# EAGLE design sht21_board (EAGLE 7.2.0)
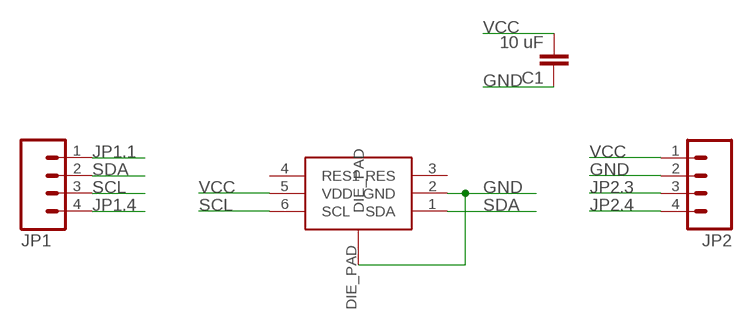
[diagram p0: schematic, sheet 1]

## Parts
C1  10 uF  CAP0805  [0805]
JP1  M04PTH  [1X04]
JP2  M04PTH  [1X04]
U$1  SHT21  [SHT21_PADS]

## Nets
GND: C1.1 JP2.2 U$1.2(GND) U$1.DIE_PAD
JP1.1: JP1.1
JP1.4: JP1.4
JP2.3: JP2.3
JP2.4: JP2.4
SCL: JP1.3 U$1.6(SCL)
SDA: JP1.2 U$1.1(SDA)
VCC: C1.2 JP2.1 U$1.5(VDD)
Unconnected: U$1.3(RES) U$1.4(RES1)

## Library data of the parts
C1 = SparkFun-Passives:CAP: Capacitor Standard 0603 ceramic capacitor, and 0.1" leaded capacitor.
JP1 JP2 = SparkFun-Connectors:M04: Header 4 Standard 4-pin 0.1" header. Use with straight break away headers (SKU : PRT-00116), right angle break away headers (PRT-00553), swiss pins (PRT-00743), machine pins (PRT-00117), and female headers (PRT-00115). Molex polarized connector foot print use with SKU : PRT-08231 with associated crimp pins and housings. 1MM SMD Version SKU: PRT-10208
U$1 = sensors:SHT21

## Board
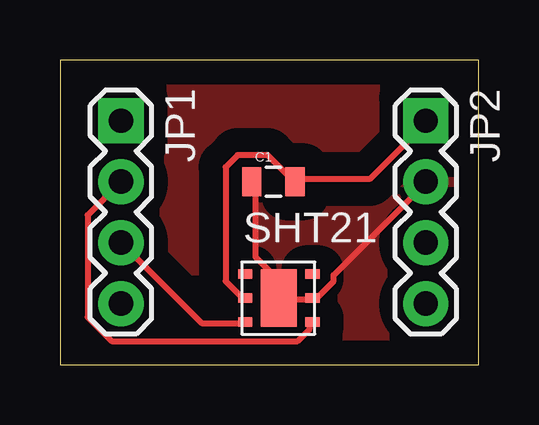
[diagram p1: board, top side]
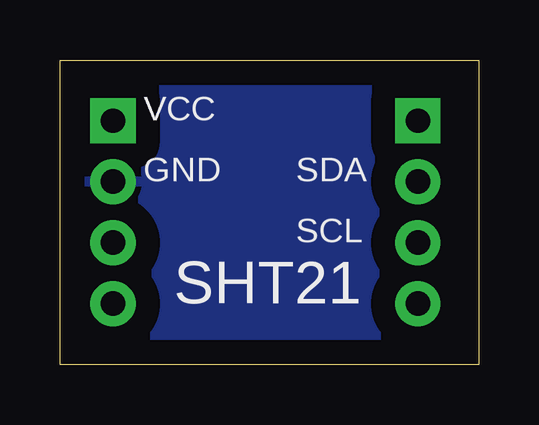
[diagram p2: board, bottom side, seen from below]

Size 17.45 x 12.69 mm. Coordinates in mm from the lower left corner, seen from the top.
Outline: 0,0 17.45,0 17.45,12.69 0,12.69 0,0
Copper layers (1*16): Top 0.035mm / dielectric 1.5mm / Bottom 0.035mm
Design rules "default *": minimum track width 0.25mm, minimum drill 0.3mm, track to track 0.25mm, track to pad 0.25mm, pad to pad 0.25mm, via to via 0.25mm, smd to smd 0.25mm, copper to edge 40mil, drill to drill 8mil, minimum pad ring 10mil, minimum via ring 8mil, stop-mask expansion 4mil, vias tented up to drill 0mil, thermal gap 10mil

### Footprints (pad centres in the part's own frame; a part is rotated, then mirrored left to right if it is on the bottom)
0805 = smd 0.8 x 1.2: 1 -0.9,0; 2 0.9,0
1X04 = drill 1.016 pad 1.88 square: 1 0,0 | drill 1.016 pad 1.88: 2 2.54,0; 3 5.08,0; 4 7.62,0
SHT21_PADS = smd 0.6 x 0.4: 1 2.9,0.5; 2 2.9,1.5; 3 2.9,2.5; 4 0.1,2.5; 5 0.1,1.5; 6 0.1,0.5 | smd 1.5 x 2.4: DIE_PAD 1.5,1.5

### Placement (x,y rotation side)
C1  8.89,7.62 0 top
JP1  2.54,10.16 270 top
JP2  15.24,10.16 270 top
U$1  7.62,1.27 0 top

### Tracks (layer width: path | path; a pad name or v marks a point on that pad's centre or on a via)
GND
  Top 0.25: C1.1 8.15,7.48 8.15,4.48 8.9,3.73 8.9,2.98 U$1.DIE_PAD 9.15,2.73 10.4,2.73 U$1.2 10.65,2.73 11.4,3.48 11.4,3.73 15.15,7.48 JP2.2
  pour Top (isolate 1): 0,12.7 17.78,12.7 17.78,0 0,0
  pour Bottom (isolate 1): 0,12.7 0,0 17.78,0 17.78,12.7
SCL
  Top 0.25: U$1.6 7.65,1.73 5.9,1.73 2.65,4.98 JP1.3
SDA
  Top 0.25: JP1.2 1.15,6.23 1.15,1.98 2.15,0.98 9.9,0.98 10.4,1.48 10.4,1.73 U$1.1
VCC
  Top 0.25: U$1.5 7.65,2.73 6.9,3.48 6.9,8.23 7.4,8.73 8.65,8.73 9.65,7.73 C1.2 9.9,7.73 12.9,7.73 15.15,9.98 JP2.1

### Text on the board
bPlace: VCC | SDA | GND | SCL | SHT21